# Altium schematic sheet Power Monitor.SchDoc: Power Monitor
size OrCAD A; DocumentNumber: LM-003; Revision: 3.0; SheetNumber: 7; SheetTotal: 11
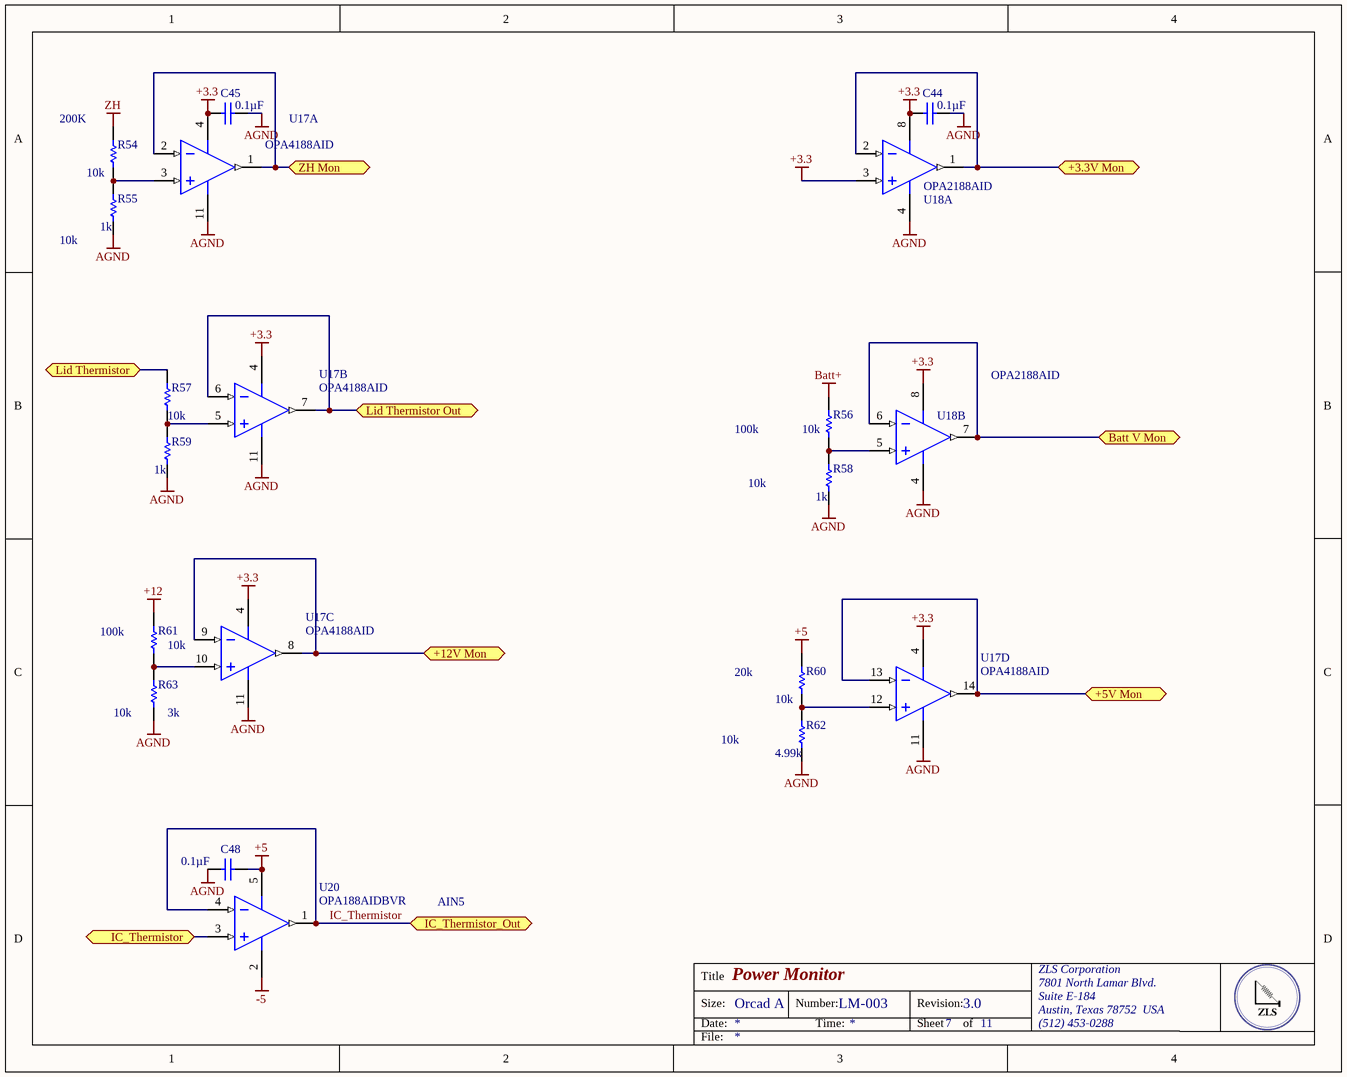
[diagram p0: Power Monitor.SchDoc]

## Parts
C44  Capacitance: 0.1µF  [CAPC0805(2012)145_N]  (hidden comment: CAP CER 0.1UF 25V X7R 0805)
C45  Capacitance: 0.1µF  [CAPC0805(2012)145_N]  (hidden comment: CAP CER 0.1UF 25V X7R 0805)
C48  Capacitance: 0.1µF  [CAPC0805(2012)145_N]  (hidden comment: CAP CER 0.1UF 16V X7R 0805)
R54  Resistance (Ohms): 10k  [RESC0805(2012)_L]  (hidden comment: RES SMD 10K OHM 1% 1/8W 0805)
R55  Resistance (Ohms): 1k  [RESC0805(2012)_L]  (hidden comment: RES SMD 1K OHM 1% 1/8W 0805)
R56  Resistance (Ohms): 10k  [RESC0805(2012)_L]  (hidden comment: RES SMD 10K OHM 1% 1/8W 0805)
R57  Resistance (Ohms): 10k  [RESC0805(2012)_L]  (hidden comment: RES SMD 10K OHM 1% 1/8W 0805)
R58  Resistance (Ohms): 1k  [RESC0805(2012)_L]  (hidden comment: RES SMD 1K OHM 1% 1/8W 0805)
R59  Resistance (Ohms): 1k  [RESC0805(2012)_L]  (hidden comment: RES SMD 1K OHM 1% 1/8W 0805)
R60  Resistance (Ohms): 10k  [RESC0805(2012)_L]  (hidden comment: RES SMD 10K OHM 1% 1/8W 0805)
R61  Resistance (Ohms): 10k  [RESC0805(2012)_L]  (hidden comment: RES SMD 10K OHM 1% 1/8W 0805)
R62  Resistance (Ohms): 4.99k  [RESC0805(2012)_L]  (hidden comment: RES SMD 4.99K OHM 1% 1/8W 0805)
R63  Resistance (Ohms): 3k  [RESC0805(2012)_L]  (hidden comment: RES SMD 3K OHM 1% 1/2W 0805)
U17  OPA4188AID  [D0014A_M]  (parts A,B,C,D of 4)
U18  OPA2188AID  [D0008A_N]  (parts A,B of 2)
U20  OPA188AIDBVR  [DBV0005A_M]

## Ports
+3.3V Mon, +5V Mon, +12V Mon, Batt V Mon, IC_Thermistor, IC_Thermistor_Out, Lid Thermistor, Lid Thermistor Out, ZH Mon

## Nets
+3.3: C44.1 C45.1 U17.4(V+) U18.3(IN_A+) U18.8(V+)
+5: C48.2 R60.2 U20.5(V+)
+12: R61.2
-5: U20.2(V-)
AGND: C44.2 C45.2 C48.1 R55.1 R58.1 R59.1 R62.1 R63.1 U17.11(V-) U18.4(V-)
Batt+: R56.2
ZH: R54.2
+3.3V Mon: U18.1(OUT_A) U18.2(IN_A-) ; port +3.3V Mon
+5V Mon: U17.13(IN_D-) U17.14(OUT_D) ; port +5V Mon
+12V Mon: U17.8(OUT_C) U17.9(IN_C-) ; port +12V Mon
Batt V Mon: U18.6(IN_B-) U18.7(OUT_B) ; port Batt V Mon
IC_Thermistor: U20.1(OUT) U20.4(IN-) ; port IC_Thermistor_Out
IC_Thermistor: U20.3(IN+) ; port IC_Thermistor  [a separate net that carries the same name]
Lid Thermistor: R57.2 ; port Lid Thermistor
Lid Thermistor Out: U17.6(IN_B-) U17.7(OUT_B) ; port Lid Thermistor Out
ZH Mon: U17.1(OUT_A) U17.2(IN_A-) ; port ZH Mon
NetR54_1: R54.1 R55.2 U17.3(IN_A+)
NetR56_1: R56.1 R58.2 U18.5(IN_B+)
NetR57_1: R57.1 R59.2 U17.5(IN_B+)
NetR60_1: R60.1 R62.2 U17.12(IN_D+)
NetR61_1: R61.1 R63.2 U17.10(IN_C+)

## Notes on the sheet
- (near R54) 200K
- (near R55) 10k
- 100k
- 10k
- (near R61) 100k
- 20k
- (near R63) 10k
- AIN5
- Title
- Size:
- Date:
- Orcad A
- Number:
- Time:
- Revision:
- Sheet
- of
- ZLS Corporation
- 7801 North Lamar Blvd.
- Suite E-184
- Austin, Texas 78752  USA
- (512) 453-0288
- File:

## Library data of the parts
C44 C45 = CMP-1036-04795-1: Manufacturer: Murata Electronics North America; Manufacturer Part Number: GRM21BR71E104KA01L; Tolerance: ±10%; Supplier 1: Digi-Key; Supplier Part Number 1: 490-1673-6-ND; RoHS: RoHS Compliant; Category: Capacitors; Stock 1: 891652; Pricing 1: 1=0.2, 10=0.145, 100=0.0683, 500=0.04788, 1000=0.03964 (USD); Packaging: Digi-Reel®; Part Status: Active; Voltage - Rated: 25V; Temperature Coefficient: X7R; Operating Temperature: -55°C ~ 125°C; Features: -; Ratings: -; Applications: General Purpose; Mounting Type: Surface Mount, MLCC; Package / Case: 0805 (2012 Metric); Size / Dimension: 0.079" L x 0.049" W (2.00mm x 1.25mm); Height - Seated (Max): -; Thickness (Max): 0.053" (1.35mm); Lead Spacing: -; Lead Style: -; ComponentLink1URL: http://www.murata.com/~/media/webrenewal/support/library/catalog/products/capacitor/mlcc/c02e.ashx; ComponentLink1Description: http://www.murata.com/~/media/webrenewal/support/library/catalog/products/capacitor/mlcc/c02e.ashx
C48 = CMP-1036-04795-1: Manufacturer: Murata Electronics North America; Manufacturer Part Number: GRM219R71C104KA01D; Tolerance: ±10%; Voltage - Rated: 25V; Supplier Part Number 1: 490-1673-6-ND; Temperature Coefficient: X7R; Thickness (Max): 0.053" (1.35mm); Supplier 2: Digi-Key; Supplier Part Number 2: 490-1683-6-ND; RoHS: RoHS Compliant; Category: Capacitors; Stock 2: 245331; Pricing 2: 1=0.14, 10=0.098, 100=0.0462, 500=0.0324, 1000=0.02683 (USD); Packaging: Digi-Reel®; Part Status: Active; Operating Temperature: -55°C ~ 125°C; Features: -; Ratings: -; Applications: General Purpose; Mounting Type: Surface Mount, MLCC; Package / Case: 0805 (2012 Metric); Size / Dimension: 0.079" L x 0.049" W (2.00mm x 1.25mm); Height - Seated (Max): -; Lead Spacing: -; Lead Style: -; ComponentLink1URL: http://www.murata.com/~/media/webrenewal/support/library/catalog/products/capacitor/mlcc/c02e.ashx; ComponentLink1Description: http://www.murata.com/~/media/webrenewal/support/library/catalog/products/capacitor/mlcc/c02e.ashx
R54 R56 R57 R60 R61 = CMP-1013-00393-1: Manufacturer: Vishay Dale; Manufacturer Part Number: CRCW080510K0FKTA; Power (Watts): 0.125W, 1/8W; Temperature Coefficient: ±100ppm/°C; Supplier 1: Digi-Key; Supplier Part Number 1: 541-3016-6-ND; RoHS: RoHS non-compliant; Category: Resistors; Stock 1: 4898; Pricing 1: 1=0.14, 10=0.129, 100=0.0496, 1000=0.02183, 2500=0.01885 (USD); Packaging: Digi-Reel®; Part Status: Active; Tolerance: ±1%; Composition: Thick Film; Features: Automotive AEC-Q200; Operating Temperature: -55°C ~ 155°C; Package / Case: 0805 (2012 Metric); Supplier Device Package: 0805; Size / Dimension: 0.079" L x 0.049" W (2.00mm x 1.25mm); Height - Seated (Max): 0.020" (0.50mm); Failure Rate: -; ComponentLink1URL: http://www.vishay.com/docs/20008/dcrcw.pdf; ComponentLink1Description: http://www.vishay.com/docs/20008/dcrcw.pdf
R55 R58 R59 = CMP-1013-00393-1: Manufacturer: Vishay Dale; Manufacturer Part Number: CRCW08051K00FKEA; Power (Watts): 0.125W, 1/8W; Temperature Coefficient: ±100ppm/°C; Supplier 1: Digi-Key; Supplier Part Number 1: 541-1.00KCDKR-ND; RoHS: RoHS Compliant; Category: Resistors; Stock 1: 34392; Pricing 1: 1=0.1, 10=0.044, 100=0.0178, 1000=0.00802, 2500=0.00696 (USD); Packaging: Digi-Reel®; Part Status: Active; Tolerance: ±1%; Composition: Thick Film; Features: Automotive AEC-Q200; Operating Temperature: -55°C ~ 155°C; Package / Case: 0805 (2012 Metric); Supplier Device Package: 0805; Size / Dimension: 0.079" L x 0.049" W (2.00mm x 1.25mm); Height - Seated (Max): 0.020" (0.50mm); Failure Rate: -; ComponentLink1URL: http://www.vishay.com/docs/20035/dcrcwe3.pdf; ComponentLink1Description: http://www.vishay.com/docs/20035/dcrcwe3.pdf
R62 = CMP-1013-00393-1: Manufacturer: Vishay Dale; Manufacturer Part Number: CRCW08054K99FKTA; Power (Watts): 0.125W, 1/8W; Temperature Coefficient: ±100ppm/°C; Supplier 1: Digi-Key; Supplier Part Number 1: 541-3030-6-ND; RoHS: RoHS non-compliant; Category: Resistors; Stock 1: 14290; Pricing 1: 1=0.14, 10=0.129, 100=0.0496, 1000=0.02183, 2500=0.01885 (USD); Packaging: Digi-Reel®; Part Status: Active; Tolerance: ±1%; Composition: Thick Film; Features: Automotive AEC-Q200; Operating Temperature: -55°C ~ 155°C; Package / Case: 0805 (2012 Metric); Supplier Device Package: 0805; Size / Dimension: 0.079" L x 0.049" W (2.00mm x 1.25mm); Height - Seated (Max): 0.020" (0.50mm); Failure Rate: -; ComponentLink1URL: http://www.vishay.com/docs/20008/dcrcw.pdf; ComponentLink1Description: http://www.vishay.com/docs/20008/dcrcw.pdf
R63 = CMP-1013-00393-1: Manufacturer: Vishay Dale; Manufacturer Part Number: CRCW08053K00FKEAHP; Power (Watts): 0.5W, 1/2W; Temperature Coefficient: ±100ppm/°C; Supplier 1: Digi-Key; Supplier Part Number 1: 541-3.00KTDKR-ND; RoHS: RoHS Compliant; Category: Resistors; Stock 1: 4756; Pricing 1: 1=0.28, 10=0.233, 100=0.0911, 1000=0.03812, 2500=0.03494 (USD); Packaging: Digi-Reel®; Part Status: Active; Tolerance: ±1%; Composition: Thick Film; Features: Automotive AEC-Q200, Pulse Withstanding; Operating Temperature: -55°C ~ 155°C; Package / Case: 0805 (2012 Metric); Supplier Device Package: 0805; Size / Dimension: 0.079" L x 0.049" W (2.00mm x 1.25mm); Height - Seated (Max): 0.020" (0.50mm); Failure Rate: -; ComponentLink1URL: http://www.vishay.com/docs/20043/crcwhpe3.pdf; ComponentLink1Description: http://www.vishay.com/docs/20043/crcwhpe3.pdf
U17 = CMP-0809-00002-2: 0.03 uV/C, Low Noise, Rail-to-Rail Output, Zero-Drift Operational Amplifier, 4 to 36 V, -40 to 125 degC, 14-pin SOIC (D14), Green (RoHS & no Sb/Br); Manufacturer: Texas Instruments; Rating: Catalog; Offset Drift(Typ)(uV/C): 0.03; Slew Rate(Typ)(V/us): 0.8; SubFamily: High Supply Voltage Amplifier (>=30V), Low Noise Amp (<=10nV/rtHz), Low Offset Voltage Amplifier (<=500uV), Low Power Amp (<=500uA), Zero Drift Precision Amplifier; Total Supply Voltage(Max)(+5V is 5, +/-5V is 10): 36; Iq per channel(Max)(mA): 0.475; Total Supply Voltage(Min)(+5V is 5, +/-5V is 10): 4; CMRR(Min)(dB): 120; Packing: TUBE; GBW(Typ)(MHz): 2; ComponentLink2URL: http://www.ti.com/lit/ds/symlink/opa4188.pdf; Mounting Technology: Surface Mount; Code_JEDEC: MS-012; ComponentLink1Description: Manufacturer URL; ComponentLink3Description: Package Specification; PackageVersion: 4040047-5/M, 06/2011; ComponentLink3URL: http://www.ti.com/lit/ml/mpds177g/mpds177g.pdf; Number of Channels: 4; Eco-Plan: Green (RoHS & no Sb/Br); PackageDescription: 14-Pin Plastic Small Outline, Body 8.65 x 3.9 mm, Pitch 1.27 mm; DatasheetVersion: SBOS641B; ComponentLink1URL: http://www.ti.com/; ComponentLink2Description: Datasheet; PackageReference: D0014A; PartNumber: OPA4188AID; PartId: 1
U18 = CMP-0272-00234-3: 0.03 uV/degC, 6 uV Vos, Low Noise, Rail-to-Rail Output, Zero-Drift Operational Amplifier, 4 to 36 V, -40 to 105 degC, 8-pin SOIC (D8), Green (RoHS & no Sb/Br); Manufacturer: Texas Instruments; CMRR(Min)(dB): 120; Number of Channels: 2; Sub Family: High Supply Voltage Amplifier (>=30V), Low Noise Amp (<=10nV/rtHz), Low Offset Voltage Amplifier (<=500uV), Low Power Amp (<=500uA), Precision Amplifier, Zero Drift Precision Amplifier; Slew Rate(Typ)(V/us): 0.8; Rating: Catalog; Vio (25C)(Max)(mV): 0.025; Iq per channel(Max)(mA): 0.475; IIB(Max)(pA): 850; Offset Drift(Typ)(uV/C): 0.03; Total Supply Voltage(Min)(+5V is 5, +/-5V is 10): 4; Total Supply Voltage(Max)(+5V is 5, +/-5V is 10): 36; Packing: TUBE; Eco-Plan: Green (RoHS & no Sb/Br); PackageReference: D0008A; ComponentLink3Description: Package Specification; PartNumber: OPA2188AID; GBW(Typ)(MHz): 2; DatasheetVersion: SBOS525B; PackageVersion: 4040047-3/M, 06/2011; Mounting Technology: Surface Mount; ComponentLink1Description: Manufacturer URL; PackageDescription: 8-Pin Plastic Small Outline, Body 4.9 x 3.9 mm, Pitch 1.27 mm; ComponentLink2Description: Datasheet; ComponentLink2URL: http://www.ti.com/lit/ds/symlink/opa2188.pdf; Code_JEDEC: MS-012; ComponentLink1URL: http://www.ti.com/; ComponentLink3URL: http://www.ti.com/litv/pdf/msoi002j; PartId: 1
U20 = CMP-0809-00005-2: Precision, Low Noise, Rail-to-Rail Output, Zero-Drift Operational Amplifier, 4 to 36 V, -40 to 125 degC, 5-pin SOT23 (DBV5), Green (RoHS & no Sb/Br); Manufacturer: Texas Instruments; Total Supply Voltage(Min)(+5V is 5, +/-5V is 10): 4; Offset Drift(Typ)(uV/C): 0.03; Rating: Catalog; SubFamily: Zero Drift Precision Amplifier; GBW(Typ)(MHz): 2; Slew Rate(Typ)(V/us): 0.8; Number of Channels: 1; CMRR(Min)(dB): 120; Iq per channel(Max)(mA): 0.51; Total Supply Voltage(Max)(+5V is 5, +/-5V is 10): 36; PartNumber: OPA188AIDBVR; ComponentLink2Description: Datasheet; ComponentLink2URL: http://www.ti.com/lit/ds/symlink/opa188.pdf; ComponentLink1Description: Manufacturer URL; Mounting Technology: Surface Mount; Eco-Plan: Green (RoHS & no Sb/Br); ComponentLink1URL: http://www.ti.com/; PackageVersion: 4073253-4/K, 03/2006; DatasheetVersion: SBOS642A; ComponentLink3Description: Package Specification; PackageReference: DBV0005A; ComponentLink3URL: http://www.ti.com/litv/pdf/mpds018i; PackageDescription: 5-Pin Plastic Small Outline, Body 1.6 x 2.9 mm, Pitch 0.95 mm; Code_JEDEC: MO-178